# EAGLE schematic PhotoInterruptor (EAGLE 7.5.0)
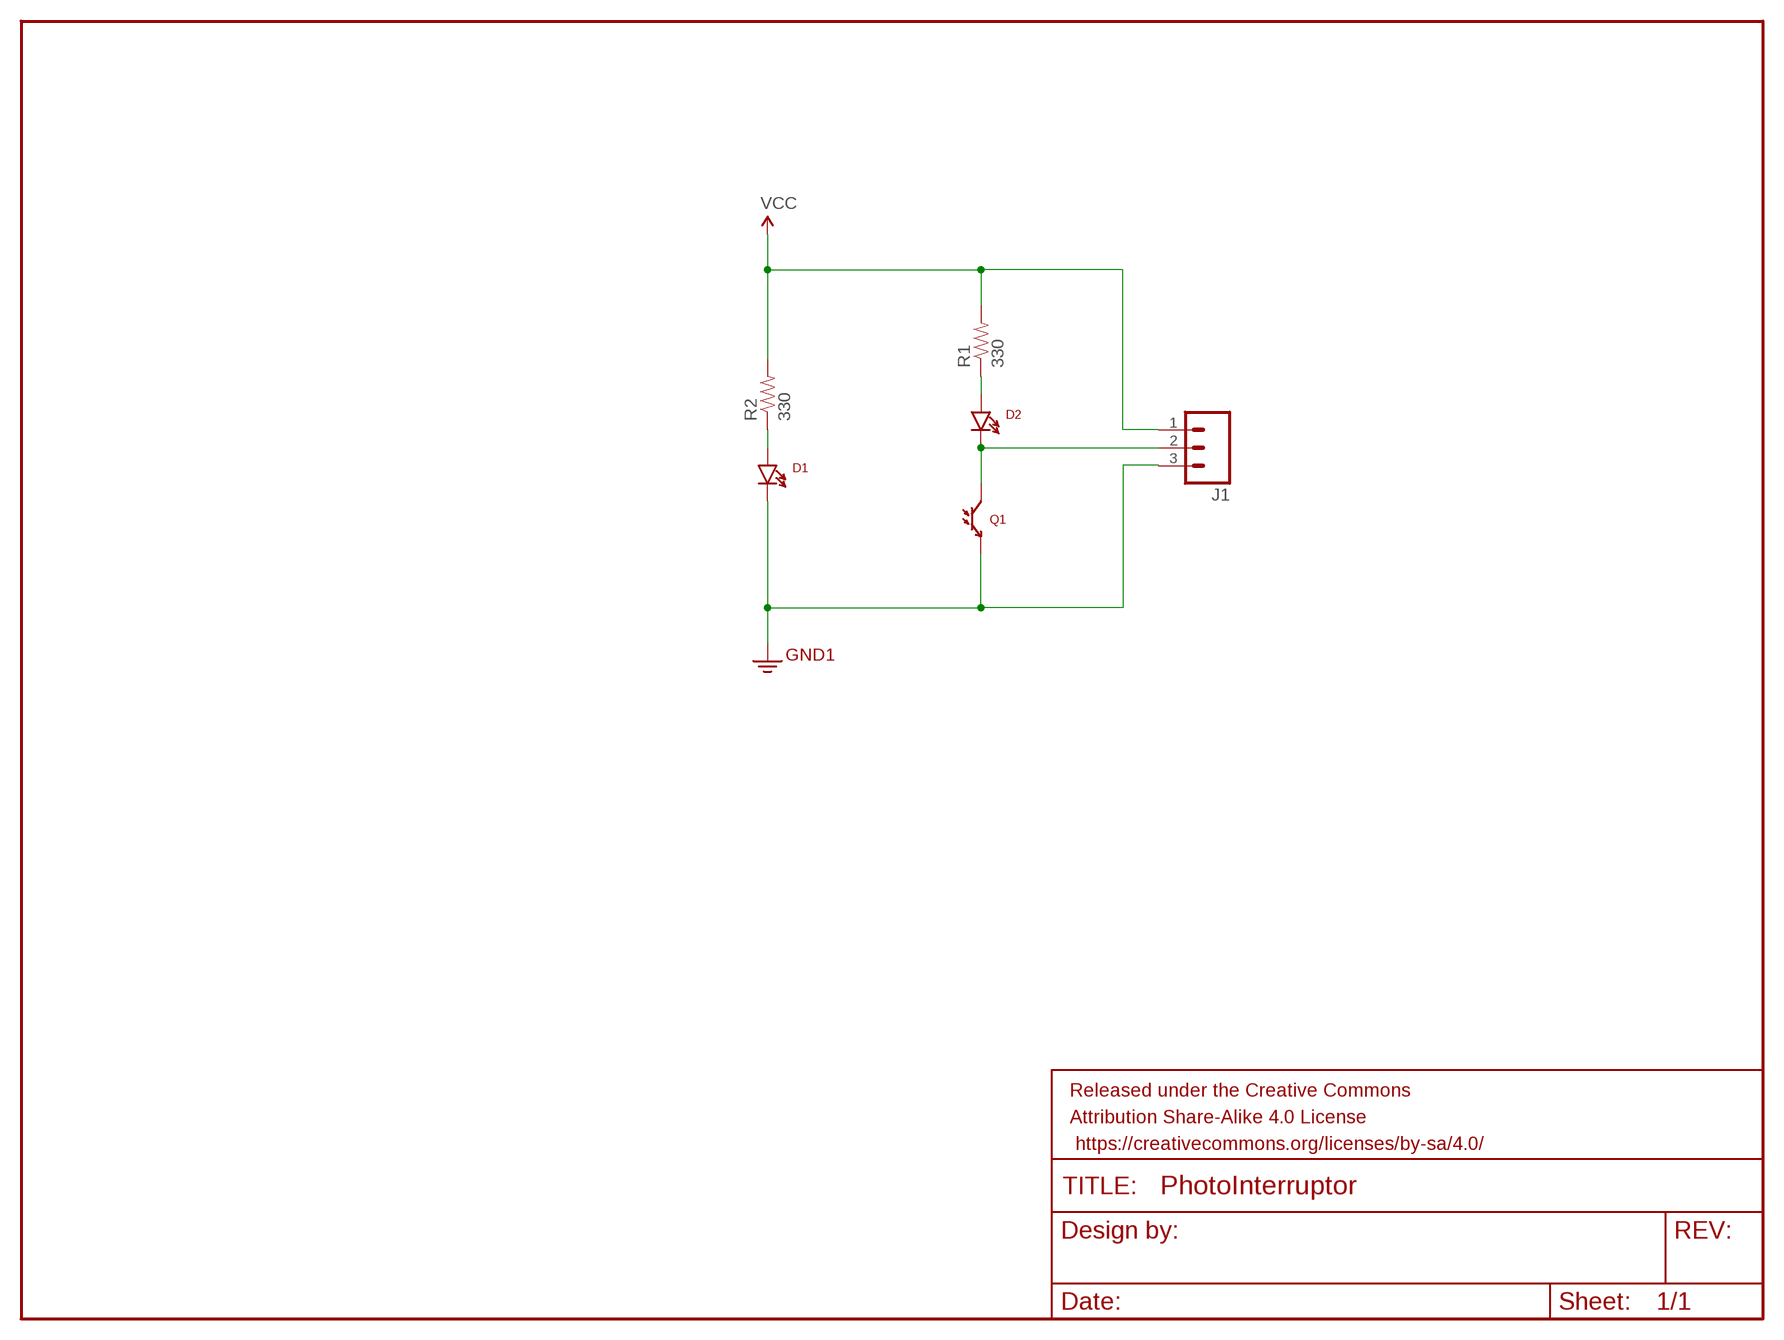
[diagram p0: schematic, sheet 1]

## Parts
D1  LTE-302  [LTE-302]
D2  LTE-302  [LTE-302]
FRAME1  FRAME-LETTERNO_PACKAGE  [DUMMY]
J1  M03POGO_PIN_HOLES_ONLY  [1X03_PP_HOLES_ONLY]
Q1  LTR-301  [LTR-301]
R1  330  10KOHM-1/4W-1%(PTH)HORIZ  [AXIAL-0.3]
R2  330  10KOHM-1/4W-1%(PTH)HORIZ  [AXIAL-0.3]

## Nets
3.3V: D1.C J1.3 Q1.E ; supply symbol labelled GND2
N$1: D1.A R2.P$1
N$2: D2.A R1.P$1
N$3: D2.C J1.2 Q1.C
VCC: J1.1 R1.P$2 R2.P$2

## Library data of the parts
D1 D2 = SparkFun-LED:LTE-302: Through-hole side-firing 940nm IR LED
FRAME1 = SparkFun-Aesthetics:FRAME-LETTER: Schematic Frame Standard 8.5x11 US Letter frame; DESIGNER: Nobody; VERSION: v01
J1 = SparkFun-Connectors:M03: Header 3 Standard 3-pin 0.1" header. Use with straight break away headers (SKU : PRT-00116), right angle break away headers (PRT-00553), swiss pins (PRT-00743), machine pins (PRT-00117), and female headers (PRT-00115). Molex polarized connector foot print use with SKU : PRT-08232 with associated crimp pins and housings.
Q1 = SparkFun-Sensors:LTR-301: Through-hole side-receiving IR phototransistor
R1 R2 = SparkFun-Resistors:10KOHM-1/4W-1%(PTH): RES-12183; PROD_ID: RES-12183; VALUE: 10k